# Altium schematic sheet LEDs.SchDoc: Science Sensor: LEDs
size Letter; Author: Emela M.; Organization: Husky Robotics; Address1: University of Washington; Address2: Mechanical Engineering; Address3: Seattle, WA; Revision: A; SheetNumber: 4; SheetTotal: 6
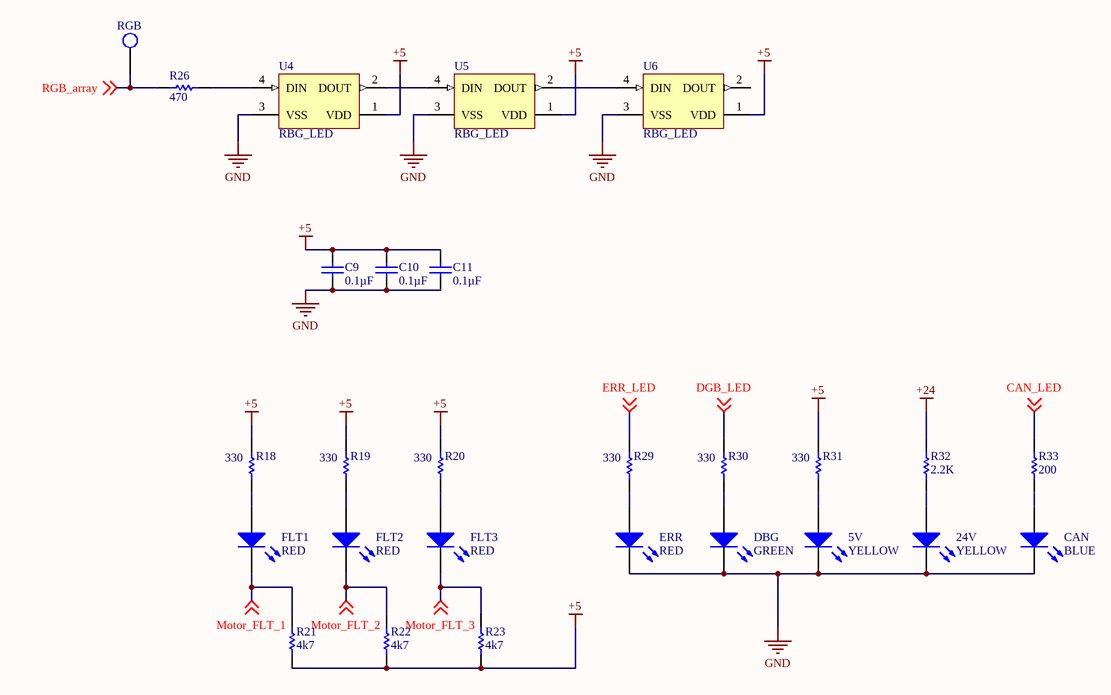
[diagram p0: LEDs.SchDoc]

## Parts
5V  YELLOW  [0805_A]
24V  YELLOW  [0805_A]
C9  Capacitance: 0.1µF  [Cap 0805]  (hidden comment: Capacitor 0805)
C10  Capacitance: 0.1µF  [Cap 0805]  (hidden comment: Capacitor 0805)
C11  Capacitance: 0.1µF  [Cap 0805]  (hidden comment: Capacitor 0805)
CAN  BLUE  [0805_A]
DBG  GREEN  [0805_A]
ERR  RED  [0805_A]
FLT1  RED  [0805_A]
FLT2  RED  [0805_A]
FLT3  RED  [0805_A]
R18  330  [RESC0805(2012)_N]
R19  330  [RESC0805(2012)_N]
R20  330  [RESC0805(2012)_N]
R21  4k7  [RESC0805(2012)_N]
R22  4k7  [RESC0805(2012)_N]
R23  4k7  [RESC0805(2012)_N]
R26  value 470  [RESC0805(2012)_N]  (hidden comment: Resistor 0805)
R29  330  [RESC0805(2012)_N]
R30  330  [RESC0805(2012)_N]
R31  330  [RESC0805(2012)_N]
R32  2.2K  [RESC0805(2012)_N]
R33  200  [RESC0805(2012)_N]
RGB  Test Point  [Test Point Through-hole]  (value not drawn)
U4  RBG_LED  [RGB_LED_1]
U5  RBG_LED  [RGB_LED_1]
U6  RBG_LED  [RGB_LED_1]

## Nets
+5: C9.2 C10.2 C11.2 R18.2 R19.2 R20.2 R21.1 R22.1 R23.1 R31.2 U4.1(VDD) U5.1(VDD) U6.1(VDD)
+24: R32.2
GND: 5V.1(K) 24V.1(K) C9.1 C10.1 C11.1 CAN.1(K) DBG.1(K) ERR.1(K) U4.3(VSS) U5.3(VSS) U6.3(VSS)
CAN_LED: R33.2 ; off-sheet CAN_LED
DGB_LED: R30.2 ; off-sheet DGB_LED
ERR_LED: R29.2 ; off-sheet ERR_LED
Motor_FLT_1: FLT1.1(K) R21.2 ; off-sheet Motor_FLT_1
Motor_FLT_2: FLT2.1(K) R22.2 ; off-sheet Motor_FLT_2
Motor_FLT_3: FLT3.1(K) R23.2 ; off-sheet Motor_FLT_3
RGB_array: R26.1 RGB.1 ; off-sheet RGB_array
Net5V_2: 5V.2(A) R31.1
Net24V_2: 24V.2(A) R32.1
NetCAN_2: CAN.2(A) R33.1
NetDBG_2: DBG.2(A) R30.1
NetERR_2: ERR.2(A) R29.1
NetFLT1_2: FLT1.2(A) R18.1
NetFLT2_2: FLT2.2(A) R19.1
NetFLT3_2: FLT3.2(A) R20.1
NetR26_2: R26.2 U4.4(DIN)
NetU4_2: U4.2(DOUT) U5.4(DIN)
NetU5_2: U5.2(DOUT) U6.4(DIN)

Not connected (* = marked no-connect by the designer): U6 2(DOUT)

## Notes on the sheet
- Title
- Size:
- Date:
- A
- Author:
- Revision:
- Sheet
- of
- File:

## Library data of the parts
5V 24V CAN DBG ERR FLT1-FLT3 = LED: Standard 0805 LED; Manufacturer: Wuerth Elektronik; PartNumber: 150080SS75000; PackageReference: 0805_A; ComponentLink2URL: http://katalog.we-online.com/led/datasheet/150080SS75000.pdf; ComponentLink1URL: http://www.we-online.com; Color: Super Red; ComponentLink2Description: Datasheet; ComponentLink1Description: Manufacturer URL
C9-C11 = Capacitor 0805: Standard Capacitor; Manufacturer: AVX; Tolerance (%): ±10%; Dielectric: X5R; Rated Voltage: 10V; Datasheet Version: 05/2016; Manufacturer URL: http://www.avx.com/; Package Description: 2-Pin Surface Mount Device, Body 2.01 x 1.25 mm; Mounting Technology: SurfaceMount; Case Size/Dimension: 0805; Package Reference: 0805; Datasheet URL: http://datasheets.avx.com/cx5r.pdf
R18-R20 R26 R29-R31 = Resistor 0805: Generic 0805 Resistor; Tolerance: 5 %; Case-Metric: 2012; Case-EIA: 0805; Power: 0.125 W; Technology: SMT
  R18-R20 R29-R31: Value: 330
R21-R23 R32 R33 = Resistor 0805: Generic 0805 Resistor; Tolerance: 5 %; Case-Metric: 2012; Value: 120R; Case-EIA: 0805; Power: 0.125 W; Technology: SMT
U4-U6 = RBG_LED: LED ADAI-WS2812B-4